# Altium schematic sheet RF.SchDoc
size A4
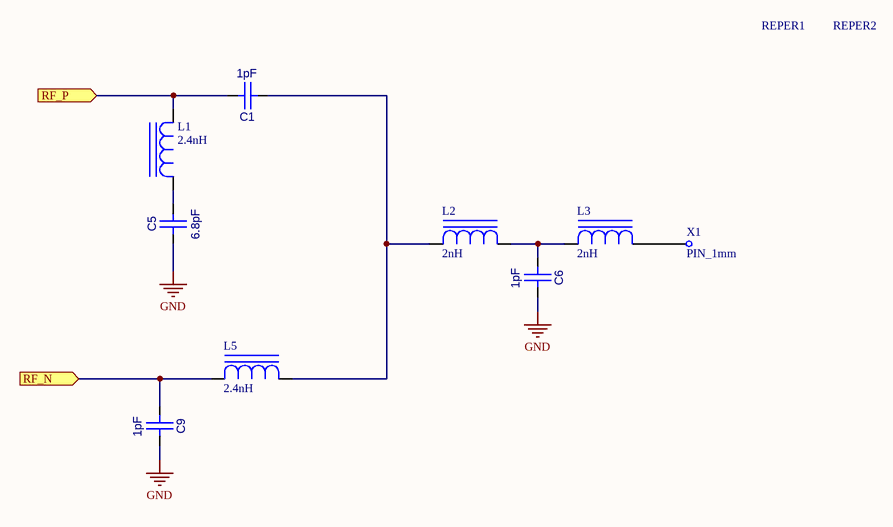
[diagram p0: RF.SchDoc]

## Parts
C1  1pF  [CC0603]
C5  6.8pF  [CC0603]
C6  1pF  [CC0603]
C9  1pF  [CC0603]
L1  2.4nH  [L0402]
L2  2nH  [L0402]
L3  2nH  [L0402]
L5  2.4nH  [L0402]
REPER1  REPER1.2  [REPER1.2]  (value not drawn)
REPER2  REPER1.2  [REPER1.2]  (value not drawn)
X1  PIN_1mm  [PIN_1mm]

## Ports
RF_N (in), RF_P (in)

## Nets
GND: C5.1(A) C6.2(B) C9.2(B)
RF_N: C9.1(A) L5.1(A) ; port RF_N
RF_P: C1.2(B) L1.2(C) ; port RF_P
NetC1_1: C1.1(A) L2.1(A) L5.2(C)
NetC5_2: C5.2(B) L1.1(A)
NetC6_1: C6.1(A) L2.2(C) L3.1(A)
NetL3_2: L3.2(C) X1.1

Not connected (* = marked no-connect by the designer): REPER1 1; REPER2 1

## Library data of the parts
C1 C5 C6 C9 = CC0603
  C1 C6 C9: Value: 1pF
  C5: Value: 6.8pF
L1-L3 L5 = L0402
  L1 L5: Value: 2.4nH
  L2 L3: Value: 2nH
REPER1 REPER2 = REPER1.2: Value: *